# Altium schematic sheet STM.SchDoc: MCU
size A4; Author: Alfonso Faria Espinoza; Organization: Waterloop; Address1: 200 University Ave W; Address2: Engineering 5, 1104; Address3: Waterloo, ON; Address4: N2L 3G1; Revision: 1.0; SheetNumber: 2; SheetTotal: 2
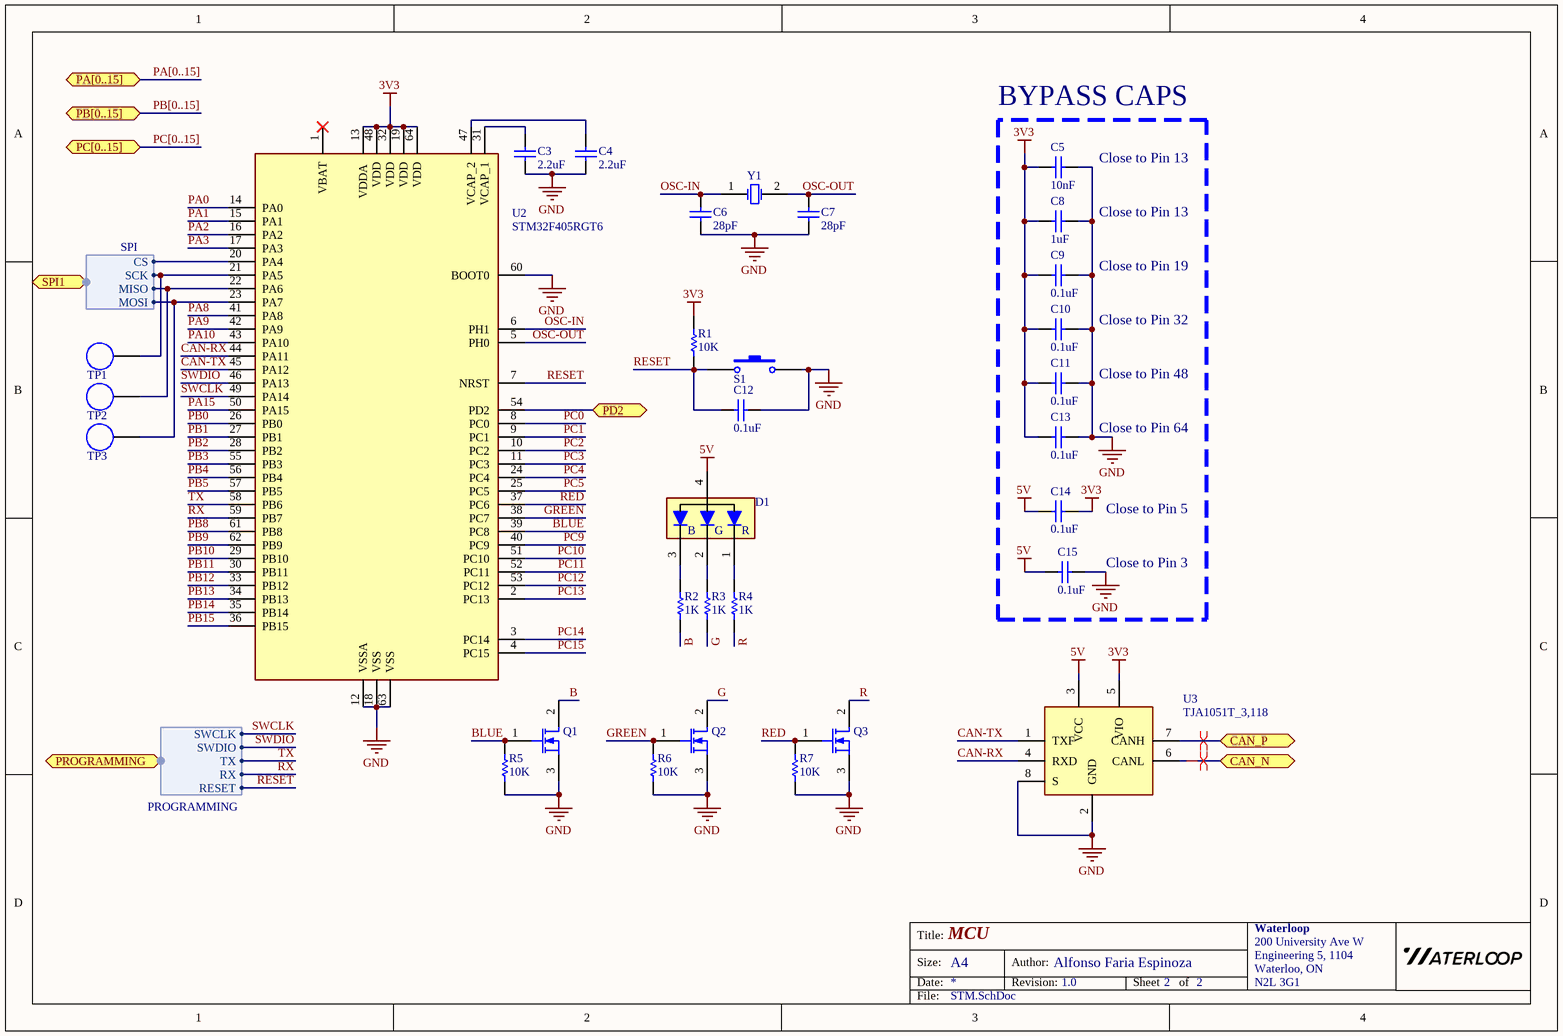
[diagram p0: STM.SchDoc]

## Parts
C3  value 2.2uF  [0805 - Capacitor]  (hidden comment: Capacitor - Nonpolarized)
C4  value 2.2uF  [0805 - Capacitor]  (hidden comment: Capacitor - Nonpolarized)
C5  value 10nF  [0805 - Capacitor]  (hidden comment: Capacitor - Nonpolarized)
C6  value 28pF  [0805 - Capacitor]  (hidden comment: Capacitor - Nonpolarized)
C7  value 28pF  [0805 - Capacitor]  (hidden comment: Capacitor - Nonpolarized)
C8  value 1uF  [0805 - Capacitor]  (hidden comment: Capacitor - Nonpolarized)
C9  value 0.1uF  [0805 - Capacitor]  (hidden comment: Capacitor - Nonpolarized)
C10  value 0.1uF  [0805 - Capacitor]  (hidden comment: Capacitor - Nonpolarized)
C11  value 0.1uF  [0805 - Capacitor]  (hidden comment: Capacitor - Nonpolarized)
C12  value 0.1uF  [0805 - Capacitor]  (hidden comment: Capacitor - Nonpolarized)
C13  value 0.1uF  [0805 - Capacitor]  (hidden comment: Capacitor - Nonpolarized)
C14  value 0.1uF  [0805 - Capacitor]  (hidden comment: Capacitor - Nonpolarized)
C15  value 0.1uF  [0805 - Capacitor]  (hidden comment: Capacitor - Nonpolarized)
D1  RGB LED- Common Anode  [4-PLCC RGB LED]  (value not drawn)
Q1  MOSFET-N  [SC70/SOT323]  (value not drawn)
Q2  MOSFET-N  [SC70/SOT323]  (value not drawn)
Q3  MOSFET-N  [SC70/SOT323]  (value not drawn)
R1  value 10K  [0603 - Resistor]  (hidden comment: Resistor)
R2  value 1K  [0603 - Resistor]  (hidden comment: Resistor)
R3  value 1K  [0603 - Resistor]  (hidden comment: Resistor)
R4  value 1K  [0603 - Resistor]  (hidden comment: Resistor)
R5  value 10K  [0603 - Resistor]  (hidden comment: Resistor)
R6  value 10K  [0603 - Resistor]  (hidden comment: Resistor)
R7  value 10K  [0603 - Resistor]  (hidden comment: Resistor)
S1  Switch - Push Button  [6x6mm Switch]  (value not drawn)
TP1  CLOCK  [Test Point]  (value not drawn)  (no BOM)
TP2  MISO  [Test Point]  (value not drawn)  (no BOM)
TP3  MOSI  [Test Point]  (value not drawn)  (no BOM)
U2  STM32F405RGT6  [STM32F405RG]
U3  TJA1051T_3,118  [TJA1051T/3,118]
Y1  Oscillator  [2-SMD NO LEAD CRSYSTAL]  (value not drawn)

## Blocks framed on the sheet
BYPASS CAPS: C5 C8-C11 C13-C15

## Ports
CAN_N (bidir), CAN_P (bidir), PA[0..15] (bidir), PB[0..15] (bidir), PC[0..15] (bidir), PD2 (bidir), PROGRAMMING (bidir, harness PROGRAMMING), SPI1 (bidir, harness SPI)

## Harnesses
SPI: CS, SCK, MISO, MOSI
PROGRAMMING: SWCLK, SWDIO, TX, RX, RESET

## Nets
3V3: C5.1 C8.1 C9.1 C10.1 C11.1 C13.1 C14.1 R1.2 U2.13(VDDA) U2.19(VDD) U2.32(VDD) U2.48(VDD) U2.64(VDD) U3.5(VIO)
5V: C14.2 C15.2 D1.4 U3.3(VCC)
GND: C3.1 C4.1 C5.2 C6.1 C7.1 C8.2 C9.2 C10.2 C11.2 C12.2 C13.2 C15.1 Q1.3(S) Q2.3(S) Q3.3(S) R5.1 R6.1 R7.1 S1.2 U2.12(VSSA) U2.18(VSS) U2.60(BOOT0) U2.63(VSS) U3.2(GND) U3.8(S)
B: Q1.2(D) R2.1
BLUE: Q1.1(G) R5.2 U2.39(PC8)
CAN-RX: U2.44(PA11) U3.4(RXD)
CAN-TX: U2.45(PA12) U3.1(TXF)
CAN_N: U3.6(CANL) ; port CAN_N
CAN_P: U3.7(CANH) ; port CAN_P
G: Q2.2(D) R3.1
GREEN: Q2.1(G) R6.2 U2.38(PC7)
OSC-IN: C6.2 U2.6(PH1) Y1.1(OSC1)
OSC-OUT: C7.2 U2.5(PH0) Y1.2(OSC2)
PA0: U2.14(PA0)
PA1: U2.15(PA1)
PA2: U2.16(PA2)
PA3: U2.17(PA3)
PA8: U2.41(PA8)
PA9: U2.42(PA9)
PA10: U2.43(PA10)
PA15: U2.50(PA15)
PB0: U2.26(PB0)
PB1: U2.27(PB1)
PB2: U2.28(PB2)
PB3: U2.55(PB3)
PB4: U2.56(PB4)
PB5: U2.57(PB5)
PB8: U2.61(PB8)
PB9: U2.62(PB9)
PB10: U2.29(PB10)
PB11: U2.30(PB11)
PB12: U2.33(PB12)
PB13: U2.34(PB13)
PB14: U2.35(PB14)
PB15: U2.36(PB15)
PC0: U2.8(PC0)
PC1: U2.9(PC1)
PC2: U2.10(PC2)
PC3: U2.11(PC3)
PC4: U2.24(PC4)
PC5: U2.25(PC5)
PC9: U2.40(PC9)
PC10: U2.51(PC10)
PC11: U2.52(PC11)
PC12: U2.53(PC12)
PC13: U2.2(PC13)
PC14: U2.3(PC14)
PC15: U2.4(PC15)
PD2: U2.54(PD2) ; port PD2
R: Q3.2(D) R4.1
RED: Q3.1(G) R7.2 U2.37(PC6)
RESET: C12.1 R1.1 S1.1 U2.7(NRST) ; port PROGRAMMING.RESET
RX: U2.59(PB7) ; port PROGRAMMING.RX
SWCLK: U2.49(PA14) ; port PROGRAMMING.SWCLK
SWDIO: U2.46(PA13) ; port PROGRAMMING.SWDIO
TX: U2.58(PB6) ; port PROGRAMMING.TX
NetC3_2: C3.2 U2.31(VCAP_1)
NetC4_2: C4.2 U2.47(VCAP_2)
NetD1_1: D1.1 R4.2
NetD1_2: D1.2 R3.2
NetD1_3: D1.3 R2.2
NetTP1_0: TP1.0 U2.21(PA5) ; port SPI1.SCK
NetTP2_0: TP2.0 U2.22(PA6) ; port SPI1.MISO
NetTP3_0: TP3.0 U2.23(PA7) ; port SPI1.MOSI
NetU2_20: U2.20(PA4) ; port SPI1.CS

Not connected (* = marked no-connect by the designer): U2 1(VBAT)*

## Buses and harness runs
bus PA[0..15] = port PA[0..15]
bus PB[0..15] = port PB[0..15]
bus PC[0..15] = port PC[0..15]

## Layout directives
differential pair; differential pair class CAN: CAN_N, CAN_P

## Notes on the sheet
- (near C5) Close to Pin 13
- Close to Pin 13
- Close to Pin 19
- Close to Pin 32
- Close to Pin 48
- Close to Pin 64
- Close to Pin 5
- (near C15) Close to Pin 3
- Title:
- Size:
- Date:
- A4
- Author:
- Revision:
- Sheet
- of
- File:
- (in symbol RGB LED- Common Anode) B; G; R

## Library data of the parts
C3 C4 = Capacitor - Nonpolarized: Nonpolarized Capacitor; Manufacturer: Samsung; Manufacturer Part Number: CL21B225KPFNNNE; Rating: 10V; Supplier Part Number: 1276-1188-1-ND; Supplier: Digikey
C5 = Capacitor - Nonpolarized: Nonpolarized Capacitor; Manufacturer: Yageo; Manufacturer Part Number: CC0805KRX7R9BB103; Rating: 50V; Supplier Part Number: 311-1136-1-ND; Supplier: Digikey
C6 C7 = Capacitor - Nonpolarized: Nonpolarized Capacitor; Manufacturer: Samsung; Manufacturer Part Number: CL21C270JCANNNC; Rating: 100V; Supplier Part Number: 1276-2622-1-ND; Supplier: Digikey
C8 = Capacitor - Nonpolarized: Nonpolarized Capacitor; Manufacturer: Yageo; Manufacturer Part Number: CC0805KKX7R9BB105; Rating: 50V; Supplier Part Number: 311-1886-1-ND; Supplier: Digikey
C9-C15 = Capacitor - Nonpolarized: Nonpolarized Capacitor; Manufacturer: Yageo; Manufacturer Part Number: CC0805KRX7R9BB104; Rating: 50V; Supplier Part Number: 311-1140-1-ND; Supplier: Digikey
D1 = RGB LED- Common Anode: Manufacturer Part Number: AAA3528LSEEZGKQBKS; Manufacturer: Kingbright; Supplier: Digikey; Supplier Part Number: 754-1967-1-ND
Q1-Q3 = MOSFET-N: N-Channel MOSFET; Manufacturer Part Number: NVS4409NT1G; Manufacturer: ON SEMI; Rating: 25V; Value: NVS4409NT1G; Supplier: Digikey; Supplier Part Number: NVS4409NT1GOSCT-ND
R1 R5-R7 = Resistor: Manufacturer Part Number: RC0603FR-0710KL; Manufacturer: Yageo; Rating: 0.1W; Supplier Part Number: 311-10.0KHRCT-ND; Supplier: Digikey
R2-R4 = Resistor: Manufacturer Part Number: RC0603FR-071KL; Manufacturer: Yageo; Rating: 0.1W; Supplier Part Number: 311-1.00KHRCT-ND; Supplier: Digikey
S1 = Switch - Push Button: Push Button Switch; Manufacturer Part Number: 1301.9315; Manufacturer: Schurter; Supplier: Digikey; Supplier Part Number: 486-3466-ND; Rating: *; Value: *
TP1-TP3 = Test Point
U2 = STM32F405RGT6: ST 64-pin Micro; Manufacturer Part Number: STM32F405RGT7; Manufacturer: ST; Supplier: Digikey; Supplier Part Number: 497-17433-ND
U3 = TJA1051T_3,118: CAN Transceiver IC 4.5V-5.5V 250ns; Manufacturer: NXP; Datasheet: http://www.nxp.com/docs/en/data-sheet/TJA1051.pdf; Manufacturer Part Number: TJA1051T/3,118; Supplier Part Number: 568-8684-1-ND; Supplier: Digikey
Y1 = Oscillator: Crystal Oscillator; Manufacturer Part Number: ABM3-16.000MHZ-B2-T; Manufacturer: Abracon; Rating: 18pF; Value: 16MHz; Supplier Part Number: 535-9103-1-ND; Supplier: Digikey